# EAGLE design Full_PCB_header (EAGLE 8.0.0)
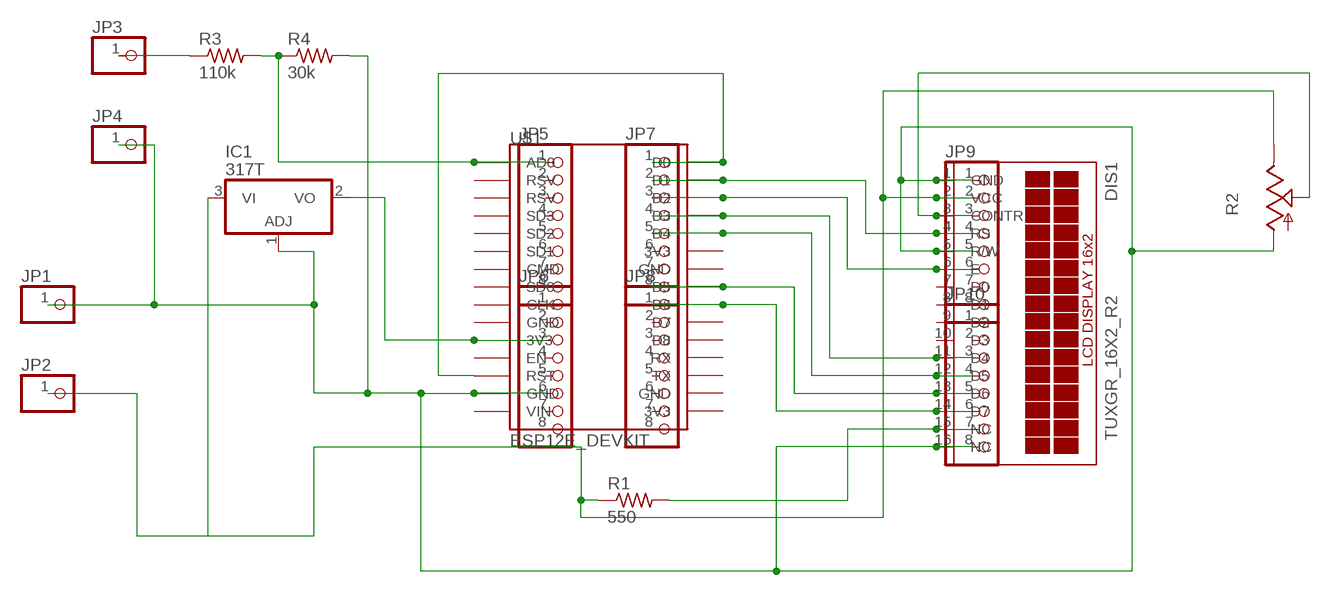
[diagram p0: schematic, sheet 1]

## Parts
DIS1  TUXGR_16X2_R2  [TUXGR_16X2_R2]
IC1  317T  [TO220H]
JP1  PINHD-1X1  [1X01]
JP2  PINHD-1X1  [1X01]
JP3  PINHD-1X1  [1X01]
JP4  PINHD-1X1  [1X01]
JP5  PINHD-1X8  [1X08]
JP6  PINHD-1X8  [1X08]
JP7  PINHD-1X8  [1X08]
JP8  PINHD-1X8  [1X08]
JP9  PINHD-1X8  [1X08]
JP10  PINHD-1X8  [1X08]
R1  550  R-US_0207/10  [0207/10]
R2  TRIM_US-B25U  [B25U]
R3  110k  R-US_0207/10  [0207/10]
R4  30k  R-US_0207/10  [0207/10]
U$1  ESP12E_DEVKIT  [ESP12E_DEVKIT]

## Nets
N$1: JP5.1 R3.2 R4.1 U$1.AD0
N$2: DIS1.2(VCC) IC1.3(VI) JP2.1 JP9.2 R1.1 R2.E
N$3: DIS1.4(RS) JP7.2 JP9.4 U$1.D1
N$4: DIS1.15(NC) JP10.7 R1.2
N$5: DIS1.6(E) JP7.3 JP9.6 U$1.D2
N$6: DIS1.11(D4) JP7.4 JP10.3 U$1.D3
N$7: DIS1.12(D5) JP7.5 JP10.4 U$1.D4
N$8: DIS1.13(D6) JP7.8 JP10.5 U$1.D5
N$9: DIS1.14(D7) JP8.1 JP10.6 U$1.D6
N$10: IC1.2(VO) JP6.3 U$1.3V3@0(3V3)
N$11: JP7.1 U$1.D0 U$1.RST
N$12: DIS1.3(CONTR) JP9.3 R2.S
N$14: JP3.1 R3.1
N$15: DIS1.1(GND) DIS1.5(R/W) DIS1.16(NC) IC1.1(ADJ) JP1.1 JP4.1 JP6.6 JP9.1 JP9.5 JP10.8 R2.A R4.2 U$1.GND@1(GND)
Unconnected: DIS1.7(D0) DIS1.8(D1) DIS1.9(D2) DIS1.10(D3) JP5.2 JP5.3 JP5.4 JP5.5 JP5.6 JP5.7 JP5.8 JP6.1 JP6.2 JP6.4 JP6.5 JP6.7 JP6.8 JP7.6 JP7.7 JP8.2 JP8.3 JP8.4 JP8.5 JP8.6 JP8.7 JP8.8 JP9.7 JP9.8 JP10.1 JP10.2 U$1.3V3@1(3V3) U$1.3V3@2(3V3) U$1.CLK U$1.CMD U$1.D7 U$1.D8 U$1.EN U$1.GND@0(GND) U$1.GND@2(GND) U$1.GND@3(GND) U$1.RSV@0(RSV) U$1.RSV@1(RSV) U$1.RX U$1.SD0 U$1.SD1 U$1.SD2 U$1.SD3 U$1.TX U$1.VIN

## Library data of the parts
DIS1 = display-lcd:TUXGR_16X2_R2: Tuxgraphics LCD display 16x2 characters reflective, without background light Source: tuxgr_12x2_r2.pdf; OC_FARNELL: unknown; OC_NEWARK: unknown
IC1 = linear:*317: Positive VOLTAGE REGULATOR
JP1-JP4 = pinhead:PINHD-1X1: PIN HEADER
JP5-JP10 = pinhead:PINHD-1X8: PIN HEADER
R1 R3 R4 = rcl:R-US_: RESISTOR, American symbol
R2 = pot:TRIM_US-: POTENTIOMETER
U$1 = ESP12E_DEVKIT:ESP12E_DEVKIT: ESP12E DEVKIT BOARD

## Board
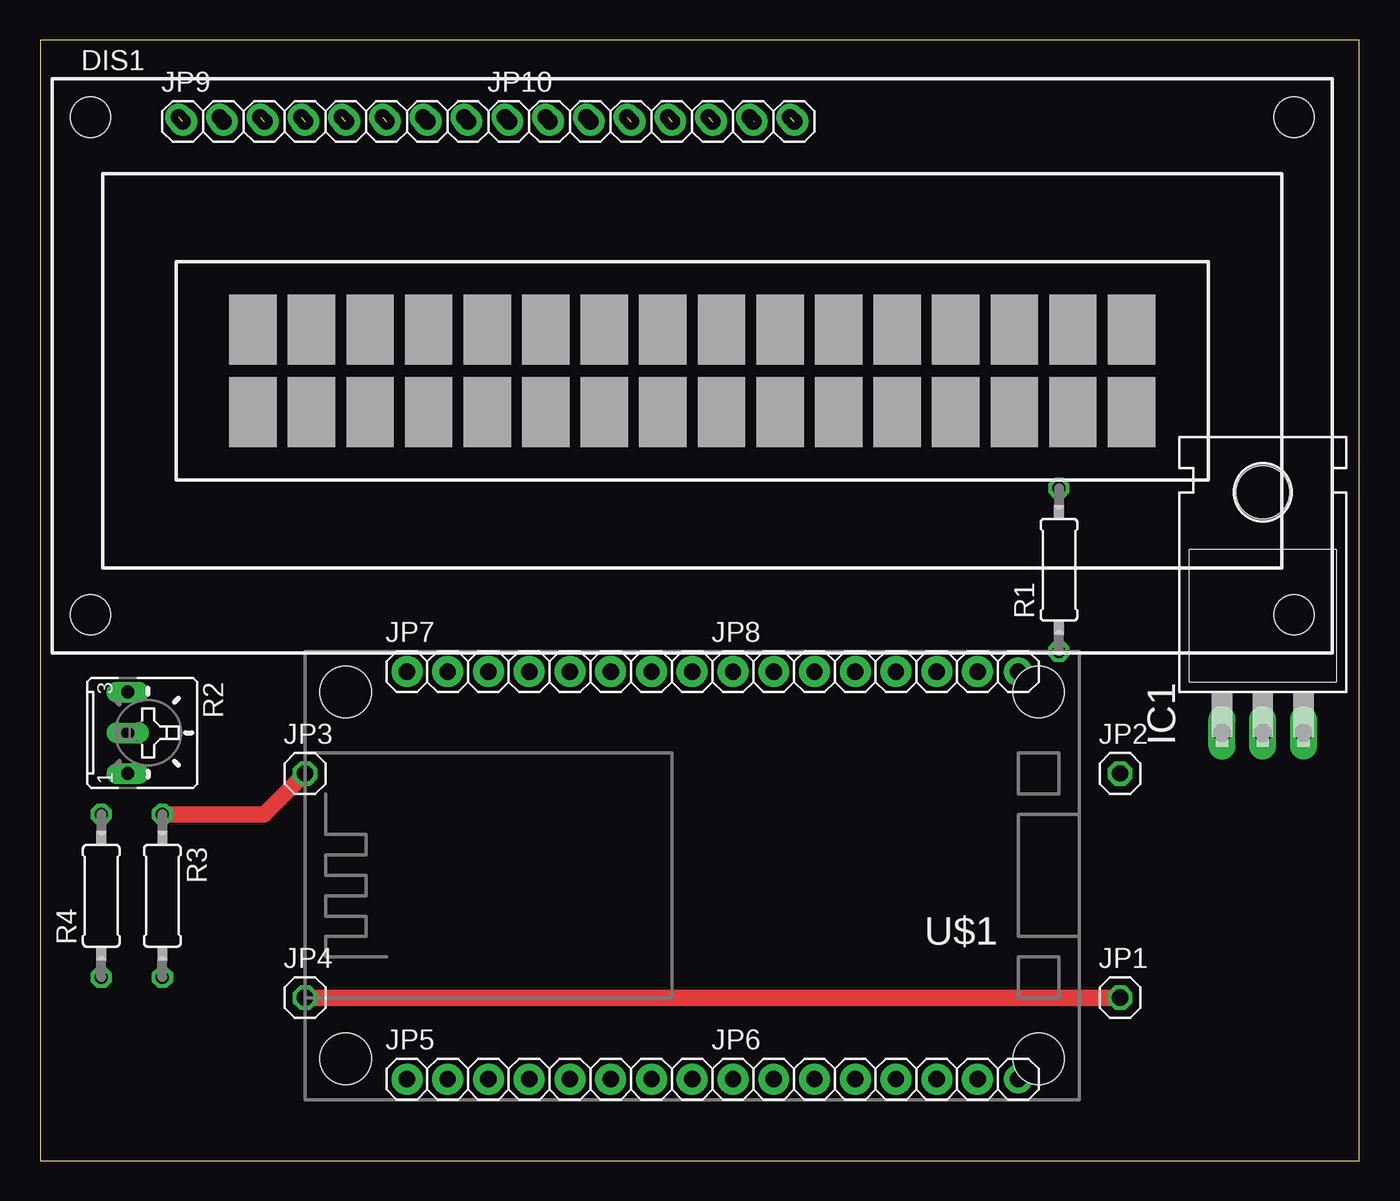
[diagram p1: board, top side]
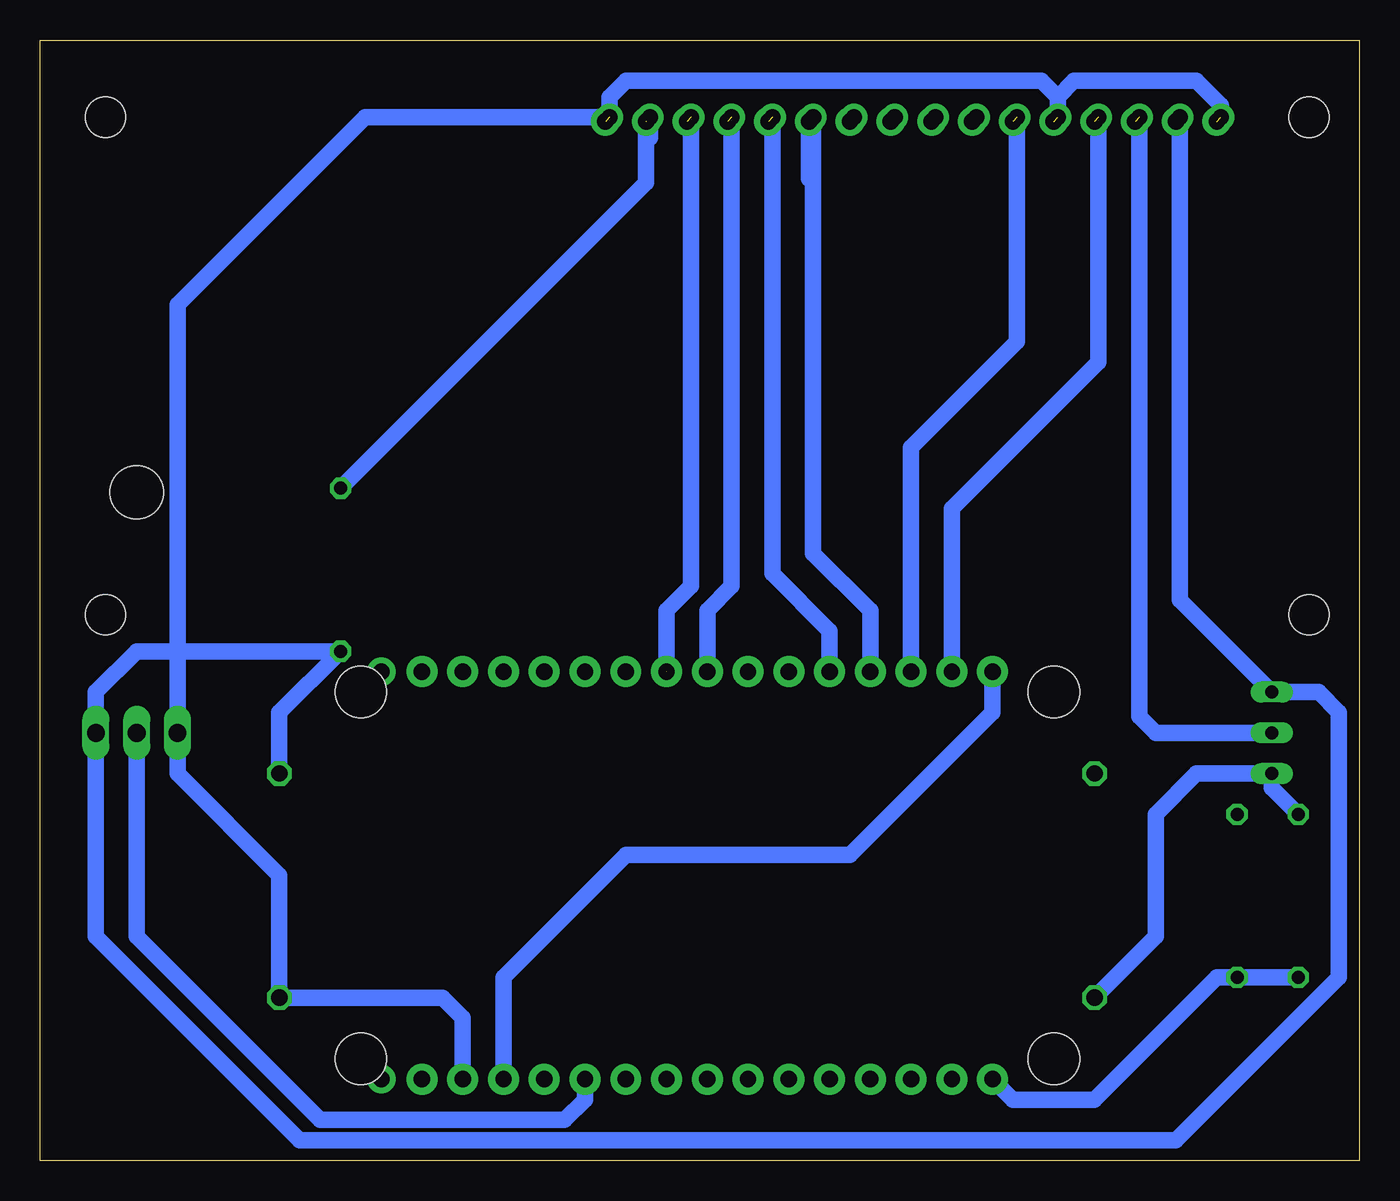
[diagram p2: board, bottom side, seen from below]

Size 82.22 x 69.84 mm. Coordinates in mm from the lower left corner, seen from the top.
Outline: 0,0 82.22,0 82.22,69.84 0,69.84 0,0
Copper layers (1*16): Top 0.035mm / dielectric 1.5mm / Bottom 0.035mm
Design rules "default": minimum track width 10mil, minimum drill 24mil, track to track 8mil, track to pad 8mil, pad to pad 8mil, via to via 8mil, smd to smd 8mil, copper to edge 40mil, drill to drill 8mil, minimum pad ring 10mil, minimum via ring 8mil, stop-mask expansion 4mil, vias tented up to drill 0mil, thermal gap 10mil

### Footprints (pad centres in the part's own frame; a part is rotated, then mirrored left to right if it is on the bottom)
TUXGR_16X2_R2 = drill 1 pad 1.676: 1 -32,15.5; 2 -29.46,15.5; 3 -26.92,15.5; 4 -24.38,15.5; 5 -21.84,15.5; 6 -19.3,15.5; 7 -16.76,15.5; 8 -14.22,15.5; 9 -11.68,15.5; 10 -9.14,15.5; 11 -6.6,15.5; 12 -4.06,15.5; 13 -1.52,15.5; 14 1.02,15.5; 15 3.56,15.5; 16 6.1,15.5 | hole 2.5: -37.5,-15.5; 37.5,-15.5; -37.5,15.5; 37.5,15.5
TO220H = drill 1.118 long: 1 -2.54,-10.16; 2 0,-10.16; 3 2.54,-10.16 | hole 3.302: 0,4.826
1X01 = drill 1.016 octagon: 1 0,0
1X08 = drill 1.016 pad 1.778: 1 -8.89,0; 2 -6.35,0; 3 -3.81,0; 4 -1.27,0; 5 1.27,0; 6 3.81,0; 7 6.35,0; 8 8.89,0
0207/10 = drill 0.813 octagon: 1 -5.08,0; 2 5.08,0
B25U = drill 0.813 long: A 2.54,-0.889; E -2.54,-0.889; S 0,-0.889
ESP12E_DEVKIT = drill 0.8 pad 1.93: 3V3@0 -12.7,-7.62; 3V3@1 12.7,5.08; 3V3@2 12.7,-17.78; AD0 -12.7,17.78; CLK -12.7,-2.54; CMD -12.7,2.54; D0 12.7,17.78; D1 12.7,15.24; D2 12.7,12.7; D3 12.7,10.16; D4 12.7,7.62; D5 12.7,0; D6 12.7,-2.54; D7 12.7,-5.08; D8 12.7,-7.62; EN -12.7,-10.16; GND@0 -12.7,-5.08; GND@1 -12.7,-15.24; GND@2 12.7,2.54; GND@3 12.7,-15.24; RST -12.7,-12.7; RSV@0 -12.7,15.24; RSV@1 -12.7,12.7; RX 12.7,-10.16; SD0 -12.7,0; SD1 -12.7,5.08; SD2 -12.7,7.62; SD3 -12.7,10.16; TX 12.7,-12.7; VIN -12.7,-17.78 | hole 3.2: -11.43,21.59; 11.43,21.59; 11.43,-21.59; -11.43,-21.59

### Placement (x,y rotation side)
DIS1  40.64,49.53 0 top
IC1  76.2,36.83 0 top
JP1  67.31,10.16 0 top
JP2  67.31,24.13 0 top
JP3  16.51,24.13 0 top
JP4  16.51,10.16 0 top
JP5  31.75,5.08 0 top
JP6  52.07,5.08 0 top
JP7  31.75,30.48 0 top
JP8  52.07,30.48 0 top
JP9  17.78,64.77 0 top
JP10  38.1,64.77 0 top
R1  63.5,36.83 90 top
R2  6.35,26.67 270 top
R3  7.62,16.51 270 top
R4  3.81,16.51 90 top
U$1  40.64,17.78 90 top

### Tracks (layer width: path | path; a pad name or v marks a point on that pad's centre or on a via)
N$1
  Bottom 1.016: R4.1 R3.2 8.89,11.43 16.51,3.81 21.59,3.81 JP5.1
N$2
  Bottom 1.016: JP2.1 67.31,27.94 R1.1 76.2,31.75 78.74,29.21 IC1.3 78.74,13.97 66.04,1.27 11.43,1.27 1.27,11.43 1.27,27.94 2.54,29.21 R2.E 11.18,34.93 DIS1.2 JP9.2
N$3  (1 unrouted)
  Bottom 1.016: 16.26,63.5 DIS1.4 16.26,63.5 | 16.26,63.5 16.26,49.78 25.4,40.64 25.4,33.02 JP7.2
N$4  (1 unrouted)
  Bottom 1.016: R1.2 44.45,60.96 44.45,63.5 | 44.45,63.5 JP10.7 DIS1.15 44.2,63.75 44.45,63.5
N$5  (1 unrouted)
  Bottom 1.016: 21.34,63.5 DIS1.6 21.34,63.5 | 21.34,63.5 21.34,51.05 27.94,44.45 27.94,33.02 JP7.3
N$6
  Bottom 1.016: 30.48,33.02 30.48,34.29 34.04,37.85 34.04,60.96 | 30.48,33.02 JP7.4 30.48,33.02 | 34.04,60.96 DIS1.11 | JP10.3 34.29,61.21 34.04,60.96
N$7  (1 unrouted)
  Bottom 1.016: 36.58,62.23 DIS1.12 36.58,62.23 | 36.58,62.23 36.58,36.58 33.02,33.02 JP7.5
N$8  (1 unrouted)
  Bottom 1.016: 39.12,62.23 DIS1.13 | 39.12,62.23 39.12,35.81 40.64,34.29 JP7.8 | DIS1.13 39.12,62.23 | DIS1.13 39.12,62.23
N$9  (2 unrouted)
  Bottom 1.016: DIS1.14 41.66,62.23 41.66,35.81 43.18,34.29 43.18,31.75 JP8.1
N$10
  Bottom 1.016: JP6.3 48.26,3.81 49.53,2.54 64.77,2.54 76.2,13.97 IC1.2
N$11
  Bottom 1.016: 22.86,29.21 JP7.1 22.86,29.21 | 22.86,29.21 22.86,27.94 31.75,19.05 45.72,19.05 53.34,11.43 U$1.RST
N$12  (1 unrouted)
  Bottom 1.016: 13.72,63.5 DIS1.3 13.72,63.5 | 13.72,63.5 13.72,27.69 12.7,26.67 R2.S
N$14
  Top 1.016: R3.1 13.97,21.59 JP3.1
N$15  (3 unrouted)
  Top 1.016: JP4.1 JP1.1
  Bottom 1.016: JP4.1 12.7,13.97 12.7,21.59 10.16,24.13 R2.A 5.46,23.24 R4.2 | JP6.6 55.88,8.89 57.15,10.16 JP1.1 67.31,17.78 73.66,24.13 IC1.1 73.66,53.34 61.97,65.03 DIS1.16 46.74,66.29 45.72,67.31 19.82,67.31 18.8,66.29 | 8.64,65.79 DIS1.1 8.64,65.79 | 8.64,65.79 10.16,67.31 17.78,67.31 18.8,66.29 | 18.8,66.29 DIS1.5 18.8,66.29